# Altium project step_up_down.PrjPcb
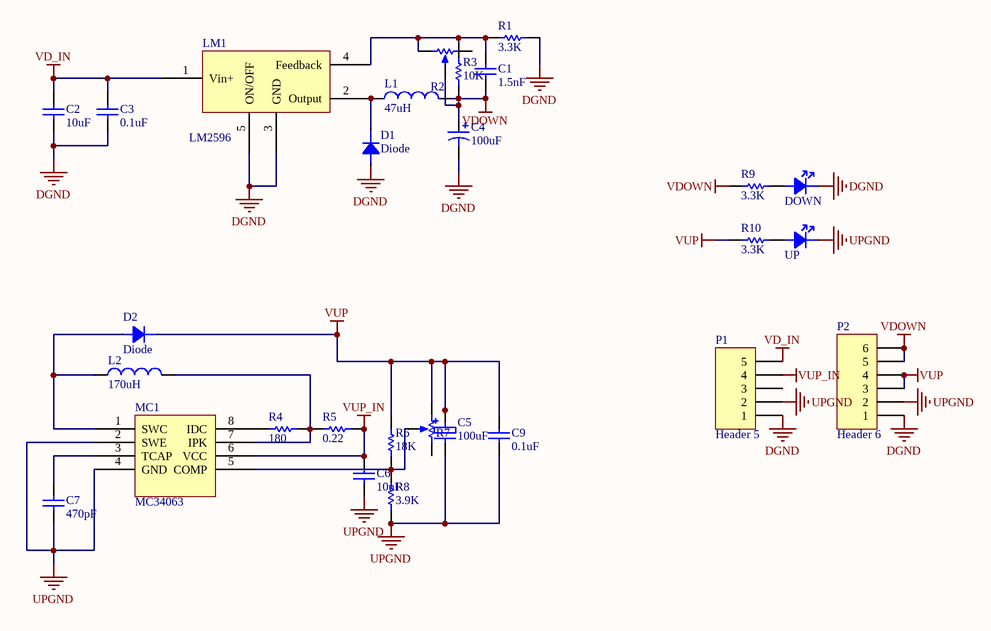
[diagram p0: step_up_down.SchDoc]
1 sheet, 28 parts. Net scope: global (net labels, ports and power ports of the same name join across sheets).
Board file: PCB.PcbDoc

## Sheet step_up_down.SchDoc
size A4

### Parts
C1  value 1.5nF  [CAP-MLCC-0603]  (hidden comment: Cap)
C2  value 10uF  [0805C]  (hidden comment: Cap)
C3  value 0.1uF  [CAP-MLCC-0603]  (hidden comment: Cap)
C4  value 100uF  [6032C]  (hidden comment: Cap Pol3)
C5  100uF  [C_ELE]
C6  value 10uF  [0805C]  (hidden comment: Cap)
C7  value 470pF  [CAP-MLCC-0603]  (hidden comment: Cap)
C9  value 0.1uF  [CAP-MLCC-0603]  (hidden comment: Cap)
D1  Diode  [SS34]
D2  Diode  [SS34]
DOWN  lED  [0805D]  (value not drawn)
L1  value 47uH  [CD74]  (hidden comment: Inductor)
L2  value 170uH  [CD74]  (hidden comment: Inductor)
LM1  LM2596  [TO-263-5]
MC1  MC34063  [LT1963-SOP8]
P1  Header 5  [HDR1X5]
P2  Header 6  [HDR1X6]
R1  value 3.3K  [RES-0603]  (hidden comment: Res1)
R2  RPot  [VR5]  (value not drawn)
R3  value 10K  [RES-0603]  (hidden comment: Res1)
R4  value 180  [RES-0603]  (hidden comment: Res1)
R5  value 0.22  [RES-0603]  (hidden comment: Res1)
R6  value 18K  [RES-0603]  (hidden comment: Res1)
R7  RPot  [VR5]  (value not drawn)
R8  value 3.9K  [RES-0603]  (hidden comment: Res1)
R9  value 3.3K  [RES-0603]  (hidden comment: Res1)
R10  value 3.3K  [RES-0603]  (hidden comment: Res1)
UP  lED  [0805D]  (value not drawn)

### Nets
DGND: C2.1 C3.1 C4.2 D1.A DOWN.K LM1.3(GND) LM1.5(ON/OFF) P1.1 P2.1 R1.1
UPGND: C5.2 C6.1 C7.1 C9.1 MC1.2(SWE) MC1.4(GND) P1.2 P2.2 R8.2 UP.K
VD_IN: C2.2 C3.2 LM1.1(Vin+) P1.5
VDOWN: C1.1 C4.1 L1.2 P2.5 P2.6 R2.2(TAP) R3.1 R9.2
VUP: C5.1 C9.2 D2.K P2.3 P2.4 R6.1 R7.1(TOP) R10.2
VUP_IN: C6.2 MC1.6(VCC) P1.4 R5.1
NetC1_2: C1.2 LM1.4(Feedback) R1.2 R2.1(TOP) R3.2
NetC7_2: C7.2 MC1.3(TCAP)
NetD1_K: D1.K L1.1 LM1.2(Output)
NetD2_A: D2.A L2.1 MC1.1(SWC)
NetDOWN_A: DOWN.A R9.1
NetL2_2: L2.2 MC1.7(IPK) R4.1 R5.2
NetMC1_5: MC1.5(COMP) R6.2 R7.2(TAP) R8.1
NetMC1_8: MC1.8(IDC) R4.2
NetR10_1: R10.1 UP.A

Not connected (* = marked no-connect by the designer): P1 3; R2 3(BOT); R7 3(BOT)

### Library data of the parts
C1-C3 C6 C7 C9 = Cap: Capacitor; Published: 8-Jun-2000; LatestRevisionDate: 17-Jul-2002; LatestRevisionNote: Re-released for DXP Platform.; PackageReference: RAD-0.3; Publisher: Altium Limited
C4 = Cap Pol3: Polarized Capacitor (Surface Mount); Published: 8-Jun-2000; LatestRevisionDate: 17-Jul-2002; LatestRevisionNote: Re-released for DXP Platform.; PackageReference: C0805; Publisher: Altium Limited
C5 = CAP-ELE: 电解电容; Value: *μF; Published: 8-Jun-2000; LatestRevisionDate: 17-Jul-2002; LatestRevisionNote: Re-released for DXP Platform.; PackageReference: RB7.6-15; Publisher: Altium Limited; PackageDescription: Polarized Capacitor (Radial); 2 Leads
DOWN UP = 00-D-LED
L1 L2 = Inductor: Code_IEC: 1005; Published: 8-Jun-2000; LatestRevisionDate: 17-Jul-2002; LatestRevisionNote: Re-released for DXP Platform.; PackageReference: 0402-A; Publisher: Altium Limited; Code_JEITA: 0402
LM1 = LM2596: 12-5
P1 = Header 5: Header, 5-Pin; LatestRevisionDate: 17-Jul-2002; LatestRevisionNote: Re-released for DXP Platform.; Publisher: Altium Limited
P2 = Header 6: Header, 6-Pin; LatestRevisionDate: 17-Jul-2002; LatestRevisionNote: Re-released for DXP Platform.; Publisher: Altium Limited
R1 R3-R6 R8-R10 = Res1: Resistor; Published: 8-Jun-2000; LatestRevisionDate: 17-Jul-2002; LatestRevisionNote: Re-released for DXP Platform.; PackageReference: AXIAL-0.3; Publisher: Altium Limited
R2 R7 = RPot: Potentiometer; Sim Note: Enter the Resistance value and the set point into parameter fields.; Set Position: 0.5; Value: 20K; Published: 8-Jun-2000; LatestRevisionDate: 17-Jul-2002; LatestRevisionNote: Re-released for DXP Platform.; PackageReference: VR5; Publisher: Altium Limited